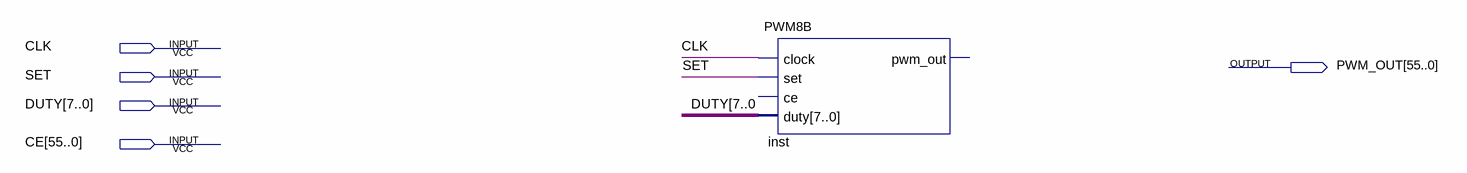
[diagram p0: schematic sheet]
// Quartus schematic PWM_block.bdf as structural Verilog: 1 symbols, 5 pins
module PWM_block (
  input  CLK,
  input  SET,
  input  [7:0] DUTY,
  input  [55:0] CE,
  output [55:0] PWM_OUT
);

  wire \DUTY[7..0 ;

  PWM8B inst (.clock(CLK), .set(SET), .duty({8{\DUTY[7..0 }}));  // open: ce, pwm_out
endmodule
